# Altium project FMP_Proto_3.0.PrjPcb
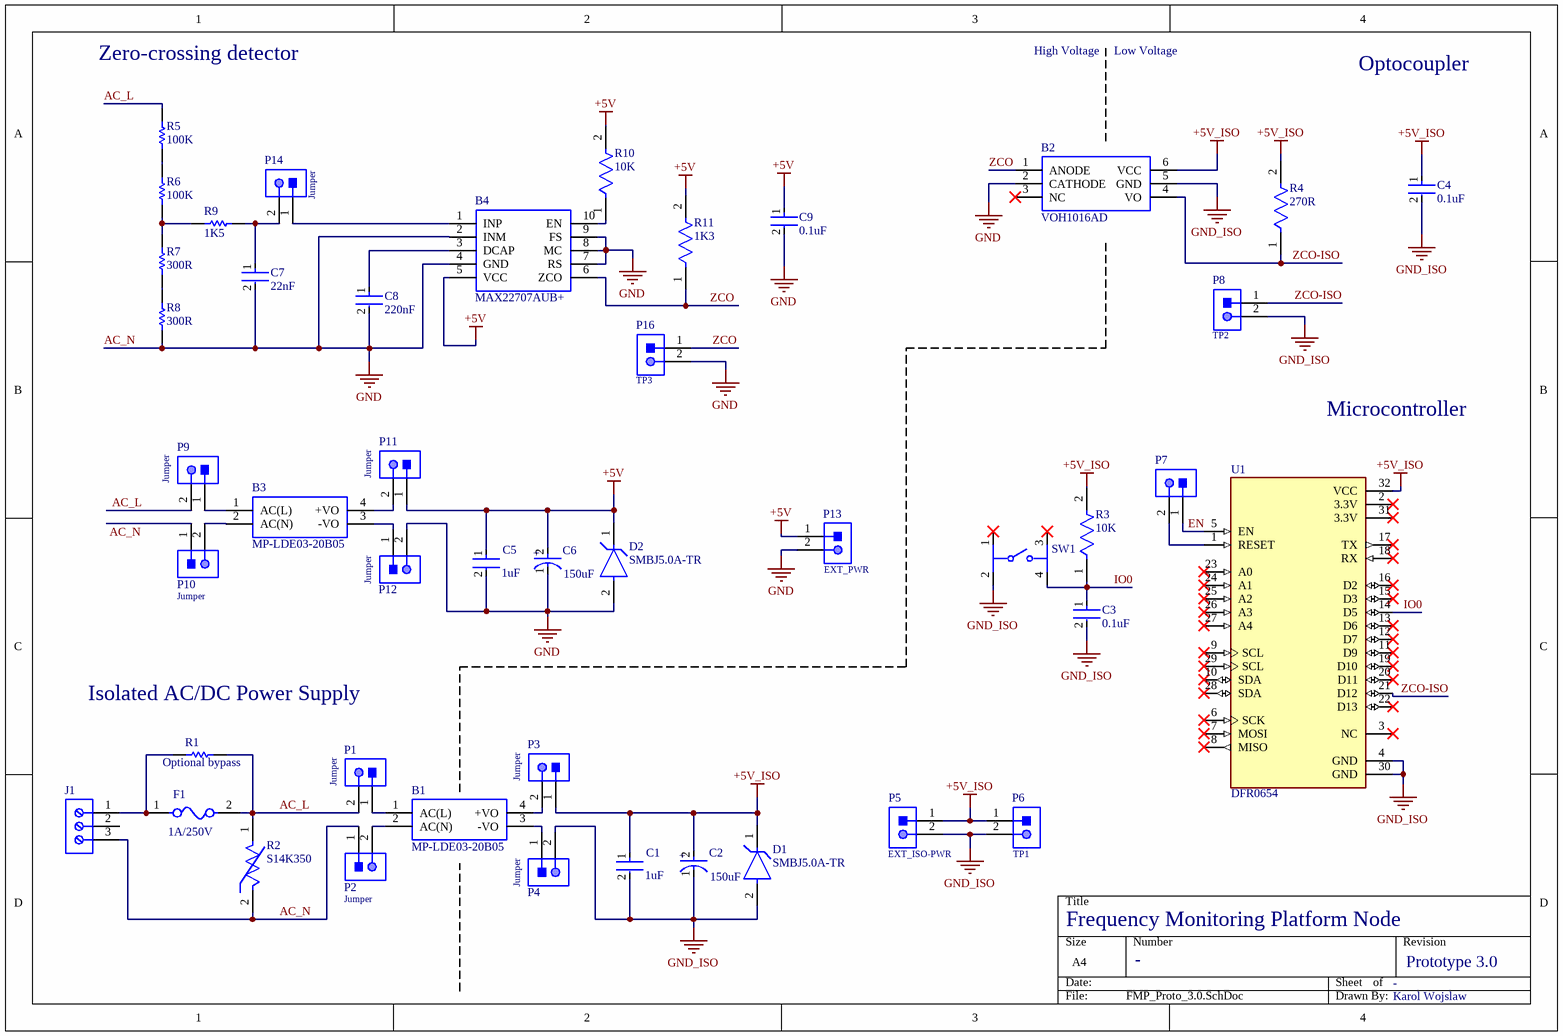
[diagram p0: FMP_Proto_3.0.SchDoc]
1 sheet, 45 parts. Net scope: global (net labels, ports and power ports of the same name join across sheets).
Board file: FMP_Proto_3.0.PcbDoc

## Sheet FMP_Proto_3.0.SchDoc
size A4; SheetNumber: 1; SheetTotal: 1

### Parts
B1  MP-LDE03-20B05  [MPLDE0320B05]
B2  VOH1016AD  [DIP762W60P254L730H450Q6N]
B3  MP-LDE03-20B05  [MPLDE0320B05]
B4  MAX22707AUB+  [SOP50P490X110-10N]
C1  1uF  [FP-C322C104K5R5TA-MFG]
C2  150uF  [FP-EEU-FR1H101B-MFG]
C3  0.1uF  [FP-C322C104K5R5TA-MFG]
C4  0.1uF  [FP-C322C104K5R5TA-MFG]
C5  1uF  [FP-C322C104K5R5TA-MFG]
C6  150uF  [FP-EEU-FR1H101B-MFG]
C7  22nF  [FP-RCE0DB-MFG]
C8  220nF  [FP-RCE0DB-MFG]
C9  0.1uF  [FP-C322C104K5R5TA-MFG]
D1  SMBJ5.0A-TR  [FP-SMB-MFG]
D2  SMBJ5.0A-TR  [FP-SMB-MFG]
F1  1A/250V  [FP-0031_8231-MFG]
J1  (no value)  [691111710003]
P1  Jumper  [61300211121]
P2  Jumper  [61300211121]
P3  Jumper  [61300211121]
P4  Jumper  [61300211121]
P5  EXT_ISO-PWR  [61300211121]
P6  TP1  [61300211121]
P7  (no value)  [61300211121]
P8  TP2  [61300211121]
P9  Jumper  [61300211121]
P10  Jumper  [61300211121]
P11  Jumper  [61300211121]
P12  Jumper  [61300211121]
P13  EXT_PWR  [61300211121]
P14  Jumper  [61300211121]
P16  TP3  [61300211121]
R1  Optional bypass  [RESC2013X60X35ML10T20]
R2  S14K350  [FP-B72214S0301K101-0]
R3  10K  [FP-CF14-MFG]
R4  270R  [FP-CF14-MFG]
R5  100K  [RESA90-1450X520]
R6  100K  [RESA90-1450X520]
R7  300R  [RESA90-1450X520]
R8  300R  [RESA90-1450X520]
R9  1K5  [RESA90-1450X520]
R10  10K  [FP-CF14-MFG]
R11  1K3  [FP-CF14-MFG]
SW1  (no value)  [FP-B3F-1005-MFG]
U1  DFR0654  [MODULE_DFR0654]

### Nets
+5V: B4.5(VCC) C5.1 C6.2(A) C9.1 D2.1(K) P11.1 P13.1 R10.2 R11.2
+5V_ISO: B2.6(VCC) C1.1 C2.2(A) C4.1 D1.1(K) P3.1 P5.1 P6.1 R3.2 R4.2 U1.32(VCC)
AC_N: B2.2(CATHODE) B4.2(INM) B4.4(GND) B4.7(RS) B4.8(MC) B4.9(FS) C5.2 C6.1(C) C7.2 C8.2 C9.2 D2.2(A) J1.3 P2.1 P10.1 P12.2 P13.2 P16.2 R2.2 R8.1  [also labelled GND]
GND_ISO: B2.5(GND) C1.2 C2.1(C) C3.2 C4.2 D1.2(A) P4.2 P5.2 P6.2 P8.2 SW1.2 U1.4(GND) U1.30(GND)
AC_L: F1.2 P1.2 P9.2 R1.2 R2.1 R5.2
EN: P7.1 U1.5(EN)
IO0: C3.1 R3.1 SW1.4 U1.14(D5)
ZCO: B2.1(ANODE) B4.6(ZCO) P16.1 R11.1
ZCO-ISO: B2.4(VO) P8.1 R4.1 U1.21(D12)
NetB1_1: B1.1(AC(L)) P1.1
NetB1_2: B1.2(AC(N)) P2.2
NetB1_3: B1.3(-VO) P4.1
NetB1_4: B1.4(+VO) P3.2
NetB3_1: B3.1(AC(L)) P9.1
NetB3_2: B3.2(AC(N)) P10.2
NetB3_3: B3.3(-VO) P12.1
NetB3_4: B3.4(+VO) P11.2
NetB4_1: B4.1(INP) P14.1
NetB4_3: B4.3(DCAP) C8.1
NetB4_10: B4.10(EN) R10.1
NetC7_1: C7.1 P14.2 R9.2
NetF1_1: F1.1 J1.1 R1.1
NetP7_2: P7.2 U1.1(RESET)
NetR5_1: R5.1 R6.1
NetR6_2: R6.2 R7.2 R9.1
NetR7_1: R7.1 R8.2

Not connected (* = marked no-connect by the designer): B2 3(NC)*; J1 2; SW1 1* 3*; U1 2(3.3V)* 3(NC)* 6(SCK)* 7(MOSI)* 8(MISO)* 9(SCL)* 10(SDA)* 11(D9)* 12(D7)* 13(D6)* 15(D3)* 16(D2)* 17(TX)* 18(RX)* 19(D10)* 20(D11)* 22(D13)* 23(A0)* 24(A1)* 25(A2)* 26(A3)* 27(A4)* 28(SDA)* 29(SCL)* 31(3.3V)*

### Notes on the sheet
- Zero-crossing detector
- High Voltage
- Low Voltage
- Optocoupler
- Microcontroller
- (near R1) Isolated AC/DC Power Supply
- Frequency Monitoring Platform Node
- -
- Prototype 3.0
- Karol Wojslaw
- (in symbol CMP-05427-000020-1) +

### Library data of the parts
B1 B3 = MP-LDE03-20B05: This is a MP-LDE03-20B05 AC/DC PCB Mount Power Supply (PSU); Manufacturer_Name: MULTICOMP; Manufacturer_Part_Number: MP-LDE06-20B24; Geometry.Height: 15.86mm; Mouser Part Number: *; Mouser Price/Stock: *; Arrow Part Number: *; Arrow Price/Stock: *; Mouser Testing Part Number: *; Mouser Testing Price/Stock: *; Datasheet Link: https://www.farnell.com/datasheets/3155173.pdf
B2 = VOH1016AD: High Speed Optocouplers 1MBps Schmitt-Trigr DIP-6; Manufacturer_Name: Vishay; Geometry.Height: 4.5mm; Mouser Part Number: 78-VOH1016AD; Mouser Price/Stock: https://www.mouser.co.uk/ProductDetail/Vishay-Semiconductors/VOH1016AD?qs=PqoDHHvF648sjq9xbZMnUg%3D%3D; Manufacturer_Part_Number: VOH1016AD; Datasheet Link: http://www.vishay.com/docs/84896/voh1016ab.pdf
B4 = MAX22707AUB+: Low Power, Integrated Zero Crossing Detector with 1% Accuracy; Manufacturer_Name: Maxim Integrated; Geometry.Height: 1.1mm; Mouser Part Number: 700-MAX22707AUB+; Mouser Price/Stock: https://www.mouser.co.uk/ProductDetail/Maxim-Integrated/MAX22707AUB%2b?qs=Li%252BoUPsLEnsUyRa6BXLUlw%3D%3D; Manufacturer_Part_Number: MAX22707AUB+; Datasheet Link: http://www.maximintegrated.com/MAX22707
C1 C3-C5 C9 = CMP-03020-034661-1: CAP CER 0.1UF 50V X7R RADIAL; Capacitance: 100nF; Dielectric Material: Ceramic; Dissipation Factor: 2.5%; Lead Length: 7mm; Tolerance: 10%; Lead Diameter: 0.51mm; Lead/Base Style: Formed Leads; Construction: RADIAL; RoHS Compliant: Yes; Voltage Rating (DC): 50V; Packaging: Bulk; Lead Free: Lead Free; Width: 0.125inch; Lead Pitch: 5.08mm; Voltage Rating: 50V; Number of Pins: 2; Radiation Hardening: No; Material: Ceramic; REACH SVHC: No SVHC; Height - Seated (Max): 0.26inch; Case/Package: Radial; Weight: 0.0625lb; Dielectric: X7R; Min Operating Temperature: -55°C; Voltage: 50V; Series: Golden Max™; Max Operating Temperature: 125°C; Height: 3.18mm; Termination: Radial; Length: 5.08mm; Depth: 3.18mm; Package Quantity: 500; Mount: Through Hole
C2 C6 = CMP-05427-000020-1: CAP ALUM 100UF 20% 50V RADIAL; Life (Hours): 6000Hour; Ripple Current: 870mA; Lead Diameter: 0.6mm; Impedance: 61mR; Tolerance: 20%; Mount: Through Hole; Lead Free: Lead Free; Length: 11.5mm; Height - Seated (Max): 0.512inch; Contact Plating: Tin; Termination: Radial; Series: FR; Max Operating Temperature: 105°C; Features: General Purpose; Min Operating Temperature: -40°C; RoHS Compliant: Yes; Height: 11.5mm; Voltage Rating (DC): 50V; Diameter: 8mm; Capacitance: 100uF; Lead Pitch: 5mm; Radiation Hardening: No; Package Quantity: 1; Case/Package: Radial; Voltage Rating: 50V; Packaging: Tape and Reel; ESR (Equivalent Series Resistance): 61mR; REACH SVHC: No SVHC
C7 = CMP-06035-045506-1: Cap Ceramic 4.7nF 100V X7R ±10% Radial 2.5mm +125°C Ammo Pack; Lead Diameter: 0.5mm; Lead/Base Style: Straight; Max Operating Temperature: 125°C; Ratings: AEC-Q200; Min Operating Temperature: -55°C; Resistor Type: Ceramic; Lead Pitch: 0.098inch; Packaging: Tape and Reel; Mount: Through Hole; Voltage Rating (DC): 100V; Termination: Radial; Width: 0.098inch; Dielectric: X7R; Voltage Rating: 100V; Height: 3.5mm; Case/Package: Radial; Length: 0.142inch; Package Quantity: 2000; Capacitance: 4.7nF; Tolerance: 10%; Height - Seated (Max): 0.138inch
C8 = CMP-06035-045506-1: Cap Ceramic; Voltage Rating (DC): 100V; Dielectric: X7R; Lead Diameter: 0.5mm; Lead/Base Style: Straight; Capacitance: 4.7nF; Tolerance: 10%; Max Operating Temperature: 125°C; Ratings: AEC-Q200; Min Operating Temperature: -55°C; Resistor Type: Ceramic; Lead Pitch: 0.098inch; Packaging: Tape and Reel; Mount: Through Hole; Termination: Radial; Width: 0.098inch; Voltage Rating: 100V; Height: 3.5mm; Case/Package: Radial; Length: 0.142inch; Package Quantity: 2000; Height - Seated (Max): 0.138inch
D1 D2 = CMP-12225-000019-1: TVS DIODE 5V 13.4V SMB; Manufacturer: STMicroelectronics; Number Of Channels: 1; Peak Pulse Power: 600W; Clamping Voltage: 14.4V; Standoff Height: 0.05mm; Peak Pulse Current: 275A; Max Junction Temp: +150°C; Direction: Unidirectional; Breakdown Voltage: 6.4V; Device Class L3: unset; Mouser Description: SMBJ Series 600 W 5 V Uni Directional SMT TVS Diode - DO-214AA; Automotive: No; Lead Free: Yes; ComponentLink2URL: https://www.st.com/resource/en/datasheet/smbj.pdf; Package: SMB; Reverse Standoff Voltage: 5V; Device Class L1: Circuit Protection; RoHS: TRUE; Temperature Range Low: -55°C; Category: Diode; Manufacturer Part Number: SMBJ5.0A-TR; Digikey Description: TVS DIODE 5V 13.4V SMB; Height: 2.65mm; Temperature Range High: +150°C; Octopart: https://octopart.com/smbj5.0a-tr-stmicroelectronics-347079; Device Class L2: TVS Diodes; ComponentLink2Description: Datasheet; Temperature: -55°C to +150°C
F1 = CMP-26292-000005-1: FUSE BLOK CARTRIDGE 600V 16A PCB; Manufacturer: Schurter; Manufacturer Part Number: 0031.8231; Voltage Rating Ac: 500V; Number Of Fuses: 1; Standoff Height: 0.7mm; Conn Orientation: Horizontal; ComponentLink2URL: https://www.schurter.com/en/datasheet/typ_OGD.pdf; Voltage Rating Dc: 600V; Package: 0; Device Class L3: unset; Digikey Description: FUSE BLOK CARTRIDGE 600V 16A PCB; Mouser Description: Fuse Holder OGD FUSEHOLDER 5X20/6.3X32; Category: Fuse; Device Class L2: Fuse Holders; Height: 12.7mm; ComponentLink2Description: Datasheet; Ambient Temperature Range Low: -40°C; Ambient Temperature Range High: +85°C; Octopart: https://octopart.com/0031.8231-schurter-8659; Automotive: No; RoHS: TRUE; Fuse Current: 16A; Lead Free: Yes; Device Class L1: Circuit Protection
J1 = CMP-1502-03263-1: Series 111 - 5.00 mm Horizontal Entry Modular with Pressure Clamp WR-TBL, 3 pin; Manufacturer: Wurth Elektronik; Pin Number: 3; Pitch: 5.00mm; Packaging: Box; Mounting Technology: THT; Part Number: 691111710003; Manufacturer URL: http://www.we-online.de; Publisher: WurthElektronik; Datasheet URL: http://katalog.we-online.de/em/datasheet/6911117100xx.pdf; Operating Temperature: -40to105degC; Package Reference: 691111710003
P1-P14 P16 = CMP-1712-00002-4: THT Vertical Pin Header WR-PHD, Pitch 2.54 mm, Single Row, 2 pins; Manufacturer: Wurth Elektronik; Rated Current: 3A; Gender: Male; Withstanding Voltage: 500VAC; Working Voltage: 250VAC; Pitch: 2.54mm; Contact Resistance: 20mOhm; Pin Number: 2; Mounting Technology: THT; Orientation: Vertical; Operating Temperature: -40to105degC; Packaging: Bag; Publisher: WurthElektronik; Datasheet URL: https://katalog.we-online.de/em/datasheet/6130xx11121.pdf; Manufacturer URL: http://www.we-online.de; Row Number: Single; Package Reference: 61300211121; Part Number: 61300211121
R1 = CMP-2100-03673-1: Chip Resistor, 0 Ohm, Jumper; Manufacturer: Yageo; Power Rating: 125mW; Resistance: 0mOhm; Voltage Rating (DC): 150V; Tolerance: 5%; Temperature Coefficient: 200ppm/degreesC; Height: 0.5mm; Depth: 1.25mm; Case Code (Imperial): 0805; Lead Free: LeadFree; Military Standard: Not; Package Description: 2-Pin Surface Mounted Device, Body 2 x 1.25 mm; Case Code (Metric): 2012; Composition: ThickFilm; Voltage Rating: 150V; Manufacturer URL: http://www.yageo.com/; Packaging: TapeandReel; Package Reference: 0805; REACH SVHC: Unknown; Case/Package: 0805; Max Operating Temperature: 155degC; Number of Pins: 2; Min Operating Temperature: -55degC; RoHSCompliant: true; Length: 2mm; Datasheet URL: http://www.yageo.com/NewPortal/yageodocoutput?fileName=/pdf/R-Chip/PYu-RC_Group_51_RoHS_L_5.pdf; Termination: SMD/SMT; Radiation Hardening: No; Width: 1.25mm; Contact Plating: Tin; Datasheet Version: Rev. 5, 10/2016
R2 = CMP-10618-000016-1: VARISTOR 560V 50A DISC 14MM; Energy: 76J; Clamping Voltage: 775V; Voltage Rating (AC): 300V; Max Surge Current: 4.5kA; Varistor Voltage: 470V; Lead Length: 30mm; Capacitance: 300pF; Lead/Base Style: Radial; Tolerance: 10%; Max Voltage Rating (DC): 385V; Packaging: Bulk; Min Operating Temperature: -40°C; Max Operating Temperature: 85°C; Depth: 5.2mm; Lead Pitch: 7.5mm; Package Quantity: 500; RoHS Compliant: Yes; Max Voltage Rating (AC): 300V; Mount: Radial; REACH SVHC: No SVHC; Thickness: 5.2mm; Series: StandardD; Diameter: 14mm; Weight: 0.141096oz; Clamping Current: 50A; Voltage Tolerance: 10%; Voltage Rating (DC): 385V
R3 R4 R10 R11 = CMP-26528-000003-1: RES 7.5K OHM 1/4W 5% AXIAL; Max Power Dissipation: 250mW; Temperature Coefficient: -400ppm/°C; Resistance: 7.5kR; RoHS Compliant: Yes; Lead Free: Lead Free; Max Operating Temperature: 155°C; Case/Package: Axial; Tolerance: 5%; Power Rating: 250mW; Diameter: 2.3mm; Features: Flame Retardant Coating; Series: CF; Resistor Type: Carbon Film; Number of Terminations: 2; Length: 0.256inch; Min Operating Temperature: -55°C; Contact Plating: Tin; Packaging: Tape and Reel; Mount: Through Hole; Radiation Hardening: No
R5 R6 = CMP-1678-00001-6: Axial Resistor, power / metal; THT; 100kΩ; 3W;±5%; Ø5,5x16mm; 350ppm/°C; Manufacturer: Ohmite; Voltage Rating: 100 mV; Min Operating Temperature: -55 degC; Length: 14.5 mm; Pins: 2; ComponentLink1URL: http://www.ohmite.com/; Packaging: Bulk; Mount: Through Hole; DatasheetVersion: 06/2015; RoHSCompliant: true; Mounting Technology: Through Hole; REACH SVHC: Unknown; ComponentLink2Description: Datasheet; PackageReference: Axial Resistor; PackageDescription: 2-Pin Axial Lead, Dia 5.2 mm, Body Length 14.5 mm; ComponentLink2URL: http://www.ohmite.com/cat/res_10.pdf; ComponentLink1Description: Manufacturer URL; Package Quantity: 10; Max Operating Temperature: 275 degC
R7 R8 = CMP-1678-00001-6: Axial Resistor, power metal; THT; 300Ω; 2W; ±5%; Ø4x11mm; 350ppm/°C; Manufacturer: Ohmite; Voltage Rating: 100 mV; Min Operating Temperature: -55 degC; Length: 14.5 mm; Pins: 2; ComponentLink1URL: http://www.ohmite.com/; Packaging: Bulk; Mount: Through Hole; DatasheetVersion: 06/2015; RoHSCompliant: true; Mounting Technology: Through Hole; REACH SVHC: Unknown; ComponentLink2Description: Datasheet; PackageReference: Axial Resistor; PackageDescription: 2-Pin Axial Lead, Dia 5.2 mm, Body Length 14.5 mm; ComponentLink2URL: http://www.ohmite.com/cat/res_10.pdf; ComponentLink1Description: Manufacturer URL; Package Quantity: 10; Max Operating Temperature: 275 degC
R9 = CMP-1678-00001-6: Axial Resistor, power metal; THT; 1,5kΩ; 2W; ±5%; Ø4x11mm; 350ppm/°C; Manufacturer: Ohmite; Voltage Rating: 100 mV; Min Operating Temperature: -55 degC; Length: 14.5 mm; Pins: 2; ComponentLink1URL: http://www.ohmite.com/; Packaging: Bulk; Mount: Through Hole; DatasheetVersion: 06/2015; RoHSCompliant: true; Mounting Technology: Through Hole; REACH SVHC: Unknown; ComponentLink2Description: Datasheet; PackageReference: Axial Resistor; PackageDescription: 2-Pin Axial Lead, Dia 5.2 mm, Body Length 14.5 mm; ComponentLink2URL: http://www.ohmite.com/cat/res_10.pdf; ComponentLink1Description: Manufacturer URL; Package Quantity: 10; Max Operating Temperature: 275 degC
SW1 = CMP-08834-000043-1: SWITCH TACTILE SPST-NO 0.05A 24V; Contact Current Rating: 50mA; Switch Travel: 0.25mm; Mechanical Life: 100000Cycles; Switch Function: Off-Mom; Throw Configuration: SPST; Illumination Type: Non-Illuminated; Actuator Type: Standard; Electrical Life: 300000Cycles; Number of Poles: 1; Ratings: IP00; Actuator Color: Orange; Contact Resistance: 100mR; Operating Force: 2.55N; Actuator Length: 0.9mm; Weight: 0.25g; Max Operating Temperature: 70°C; Packaging: Bag; Depth: 6mm; Package Quantity: 1500; Lead Free: Lead Free; Voltage Rating (DC): 24V; Termination: PC Pins; Length: 6mm; Contact Material: Gold; Min Operating Temperature: -25°C; Mount: Through Hole; Max Voltage Rating (DC): 24V; Current Rating: 50mA; Max Current Rating: 50mA; Orientation: Straight; Width: 6mm; Height: 4.3mm; Series: B3F; Contact Plating: Silver
U1 = DFR0654: ESP32-E series Transceiver; 802.11 b/g/n/d/e/i/k/r (Wi-Fi, WiFi, WLAN), Bluetooth Smart 4.x Low Energy (BLE) Evaluation Board; MF: DFRobot; MP: DFR0654; Availability: In Stock; SnapEDA_Link: https://www.snapeda.com/parts/DFR0654/DFRobot/view-part/?ref=snap; Check_prices: https://www.snapeda.com/parts/DFR0654/DFRobot/view-part/?ref=eda; Package: None; Purchase-URL: https://pricing.snapeda.com/search/part/DFR0654/?ref=eda; Price: None; Value: *